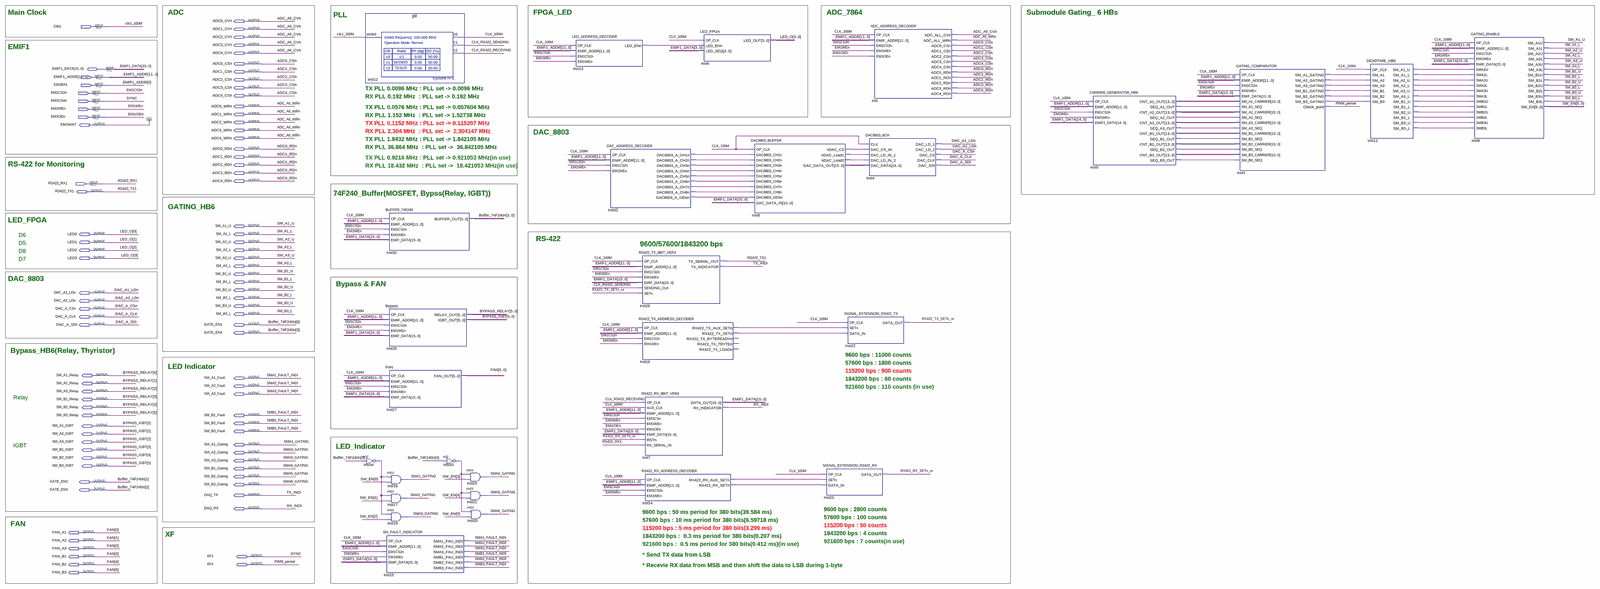
[diagram p0: schematic sheet, whole]
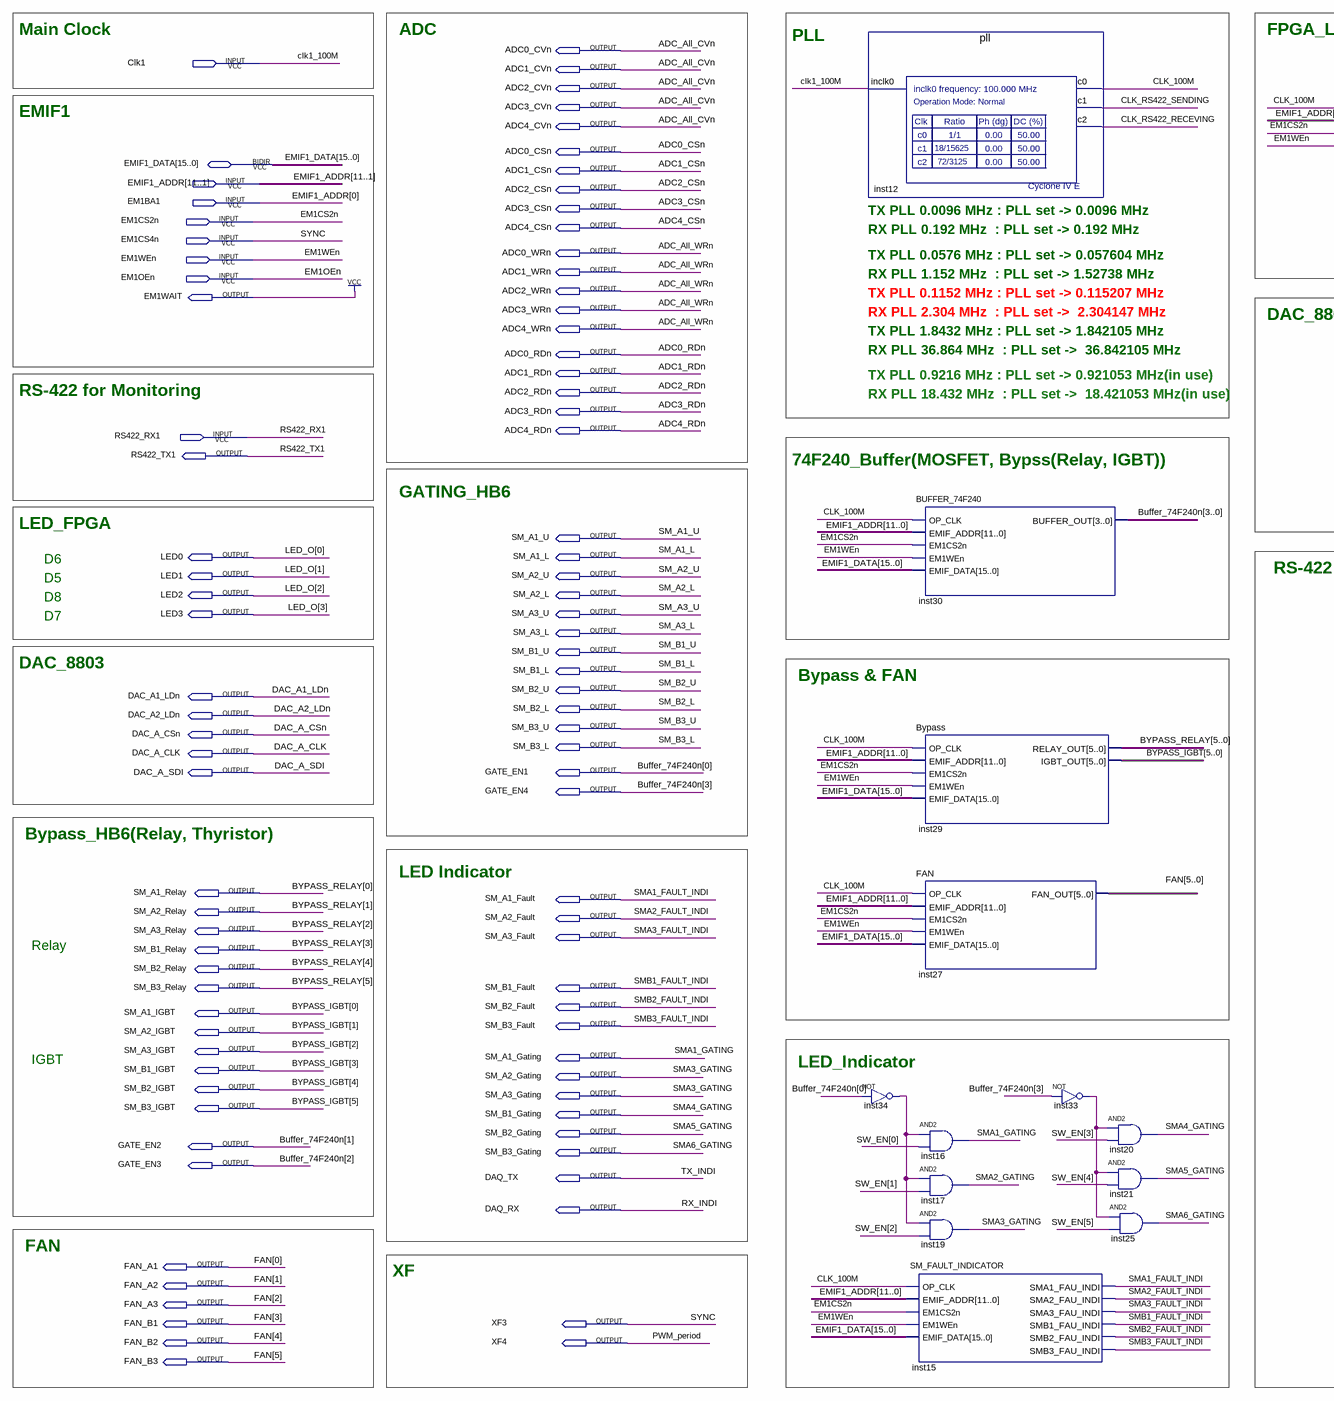
[diagram p1: schematic sheet, left part]
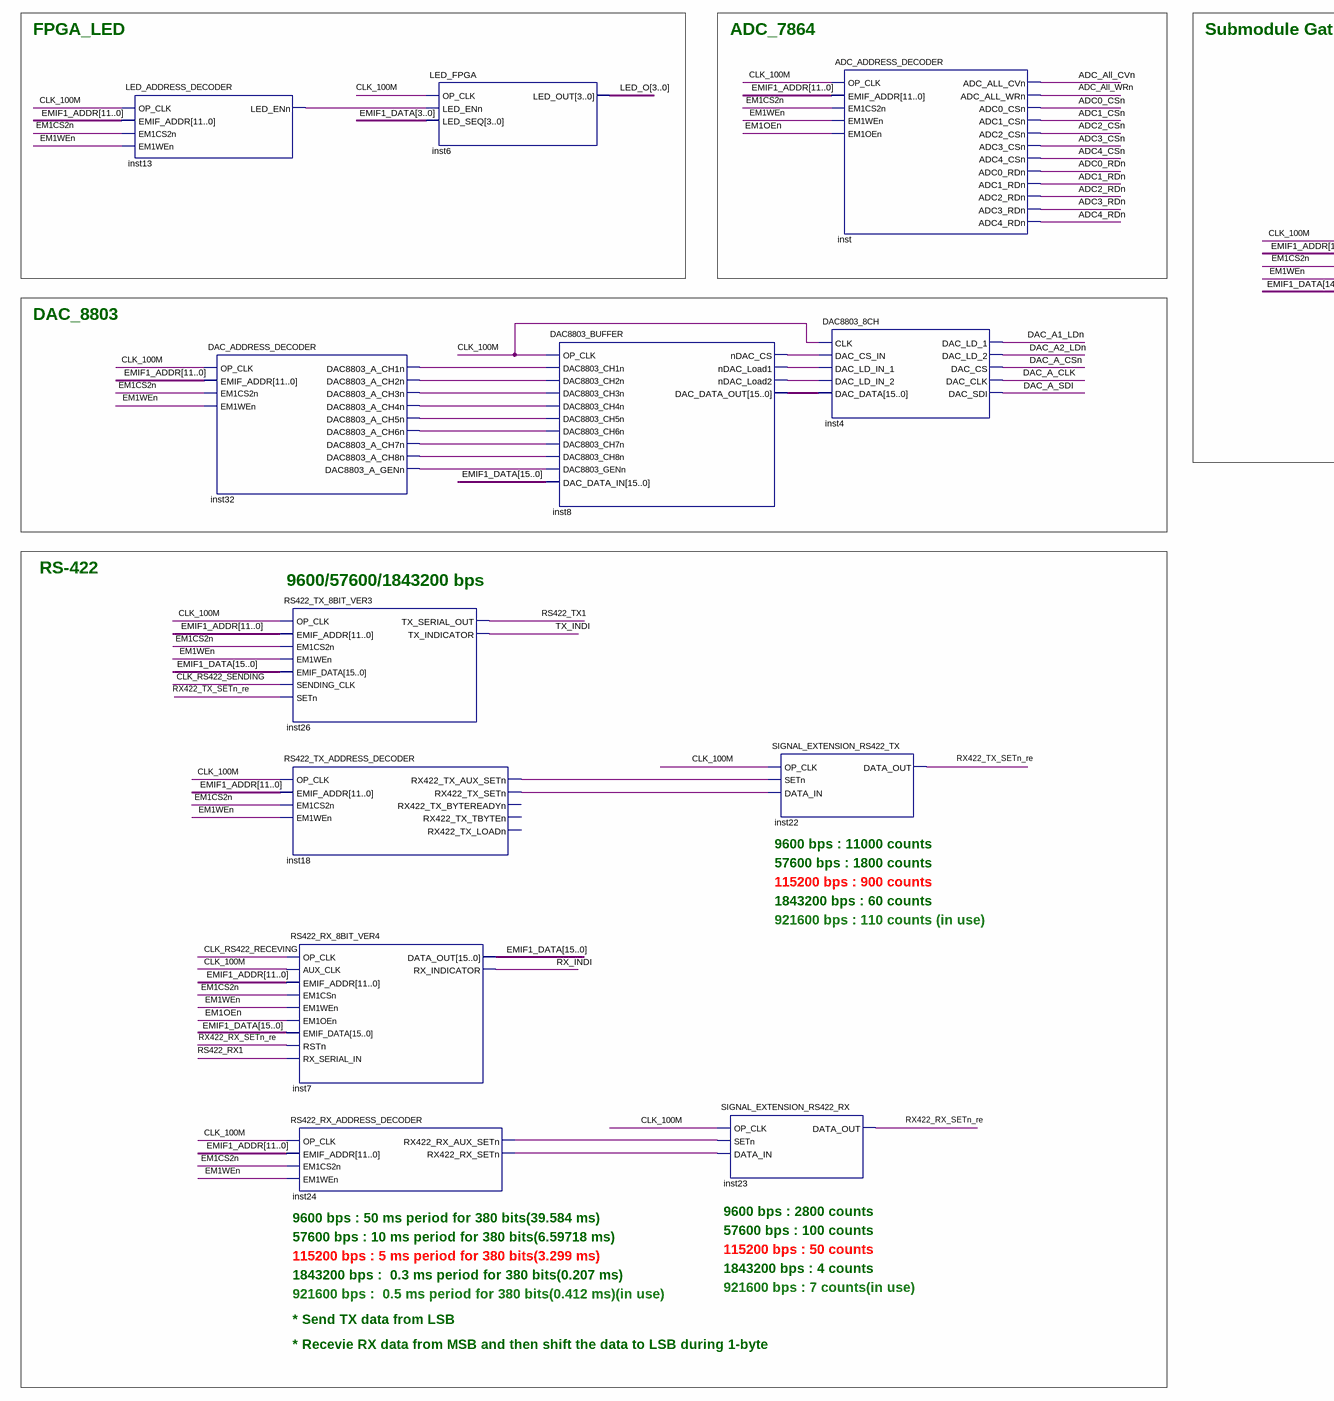
[diagram p2: schematic sheet, centre part]
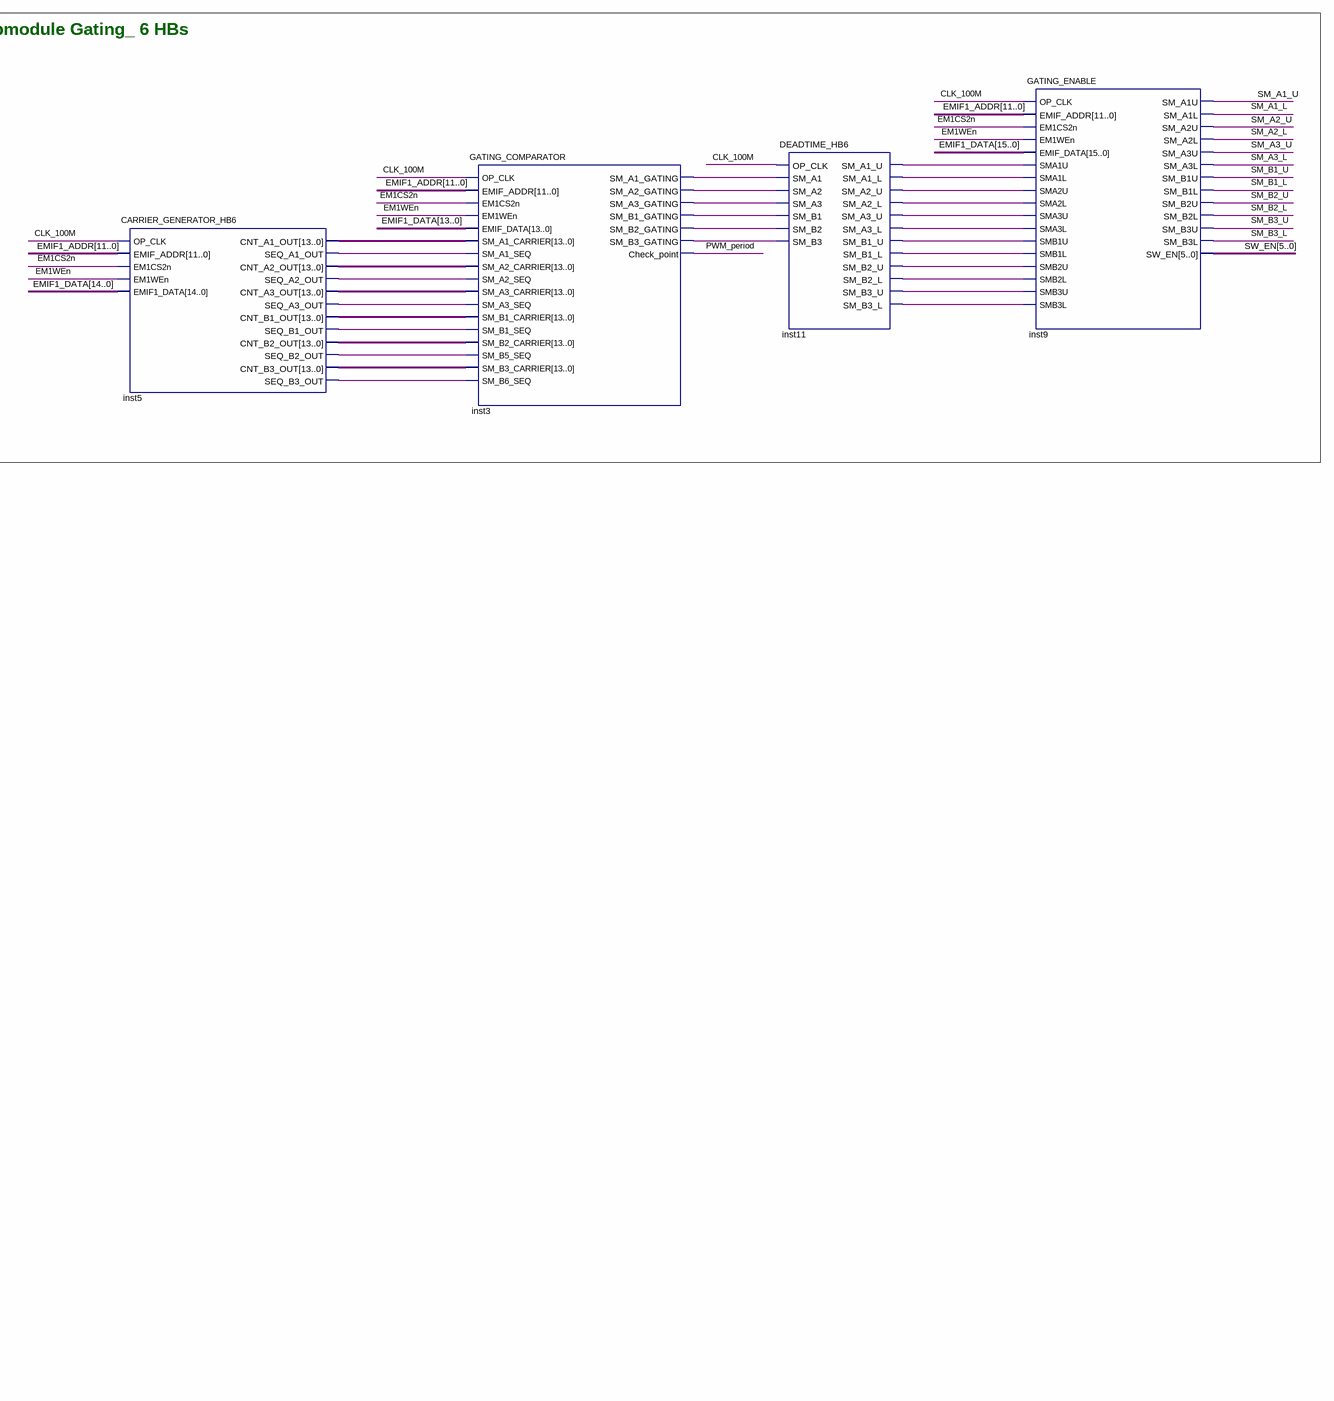
[diagram p3: schematic sheet, right part]
// Quartus schematic Groupmodule_Controller_31Lv.bdf as structural Verilog: 29 symbols, 90 pins
module Groupmodule_Controller_31Lv (
  input  Clk1,
  input  [11:1] EMIF1_ADDR,
  input  EM1BA1,
  input  EM1CS2n,
  input  EM1CS4n,
  input  EM1WEn,
  input  EM1OEn,
  input  RS422_RX1,
  inout  [15:0] EMIF1_DATA,
  output ADC0_CVn,
  output ADC1_CVn,
  output ADC2_CVn,
  output ADC3_CVn,
  output ADC4_CVn,
  output ADC0_CSn,
  output ADC1_CSn,
  output ADC2_CSn,
  output ADC3_CSn,
  output ADC4_CSn,
  output ADC0_WRn,
  output ADC1_WRn,
  output ADC2_WRn,
  output EM1WAIT,
  output ADC3_WRn,
  output ADC4_WRn,
  output ADC0_RDn,
  output ADC1_RDn,
  output ADC2_RDn,
  output ADC3_RDn,
  output ADC4_RDn,
  output RS422_TX1,
  output SM_A1_U,
  output LED0,
  output SM_A1_L,
  output LED1,
  output SM_A2_U,
  output LED2,
  output SM_A2_L,
  output LED3,
  output SM_A3_U,
  output SM_A3_L,
  output SM_B1_U,
  output SM_B1_L,
  output SM_B2_U,
  output DAC_A1_LDn,
  output SM_B2_L,
  output DAC_A2_LDn,
  output SM_B3_U,
  output DAC_A_CSn,
  output SM_B3_L,
  output DAC_A_CLK,
  output DAC_A_SDI,
  output GATE_EN1,
  output GATE_EN4,
  output SM_A1_Relay,
  output SM_A1_Fault,
  output SM_A2_Relay,
  output SM_A2_Fault,
  output SM_A3_Relay,
  output SM_A3_Fault,
  output SM_B1_Relay,
  output SM_B2_Relay,
  output SM_B3_Relay,
  output SM_B1_Fault,
  output SM_B2_Fault,
  output SM_A1_IGBT,
  output SM_B3_Fault,
  output SM_A2_IGBT,
  output SM_A3_IGBT,
  output SM_A1_Gating,
  output SM_B1_IGBT,
  output SM_A2_Gating,
  output SM_B2_IGBT,
  output SM_A3_Gating,
  output SM_B3_IGBT,
  output SM_B1_Gating,
  output SM_B2_Gating,
  output GATE_EN2,
  output SM_B3_Gating,
  output GATE_EN3,
  output DAQ_TX,
  output DAQ_RX,
  output FAN_A1,
  output FAN_A2,
  output FAN_A3,
  output FAN_B1,
  output XF3,
  output FAN_B2,
  output XF4,
  output FAN_B3
);

  wire CLK_100M, CLK_RS422_RECEVING, CLK_RS422_SENDING, inst3_sm_a1_gating, inst3_sm_a2_gating,
       inst3_sm_a3_gating, inst3_sm_b1_gating, inst3_sm_b2_gating, inst3_sm_b3_gating, inst5_seq_a1_out,
       inst5_seq_a2_out, inst5_seq_a3_out, inst5_seq_b1_out, inst5_seq_b2_out, inst5_seq_b3_out,
       inst8_ndac_cs, inst8_ndac_load1, inst8_ndac_load2, inst11_sm_a1_l, inst11_sm_a1_u, inst11_sm_a2_l,
       inst11_sm_a2_u, inst11_sm_a3_l, inst11_sm_a3_u, inst11_sm_b1_l, inst11_sm_b1_u, inst11_sm_b2_l,
       inst11_sm_b2_u, inst11_sm_b3_l, inst11_sm_b3_u, inst13_led_enn, inst18_rx422_tx_aux_setn,
       inst18_rx422_tx_setn, inst24_rx422_rx_aux_setn, inst24_rx422_rx_setn, inst32_dac8803_a_ch1n,
       inst32_dac8803_a_ch2n, inst32_dac8803_a_ch3n, inst32_dac8803_a_ch4n, inst32_dac8803_a_ch5n,
       inst32_dac8803_a_ch6n, inst32_dac8803_a_ch7n, inst32_dac8803_a_ch8n, inst32_dac8803_a_genn,
       inst33_out, inst34_out, RX422_RX_SETn_re, RX422_TX_SETn_re, SMA2_GATING;
  wire [5:0] SW_EN;
  wire [13:0] inst5_cnt_a1_out, inst5_cnt_a2_out, inst5_cnt_a3_out, inst5_cnt_b1_out, inst5_cnt_b2_out,
       inst5_cnt_b3_out;
  wire [15:0] inst8_dac_data_out;

  pll inst12 (.inclk0(Clk1), .c0(CLK_100M), .c1(CLK_RS422_SENDING), .c2(CLK_RS422_RECEVING));
  not inst34 (inst34_out, GATE_EN1);
  BUFFER_74F240 inst30 (
    .OP_CLK(CLK_100M), .EMIF_ADDR({EMIF1_ADDR, EM1BA1}), .EM1CS2n(EM1CS2n), .EM1WEn(EM1WEn),
    .EMIF_DATA(EMIF1_DATA), .BUFFER_OUT({GATE_EN4, GATE_EN3, GATE_EN2, GATE_EN1}));
  Bypass inst29 (
    .OP_CLK(CLK_100M), .EMIF_ADDR({EMIF1_ADDR, EM1BA1}), .EM1CS2n(EM1CS2n), .EM1WEn(EM1WEn),
    .EMIF_DATA(EMIF1_DATA),
    .RELAY_OUT({SM_B3_Relay, SM_B2_Relay, SM_B1_Relay, SM_A3_Relay, SM_A2_Relay, SM_A1_Relay}),
    .IGBT_OUT({SM_B3_IGBT, SM_B2_IGBT, SM_B1_IGBT, SM_A3_IGBT, SM_A2_IGBT, SM_A1_IGBT}));
  FAN inst27 (
    .OP_CLK(CLK_100M), .EMIF_ADDR({EMIF1_ADDR, EM1BA1}), .EM1CS2n(EM1CS2n), .EM1WEn(EM1WEn),
    .EMIF_DATA(EMIF1_DATA), .FAN_OUT({FAN_B3, FAN_B2, FAN_B1, FAN_A3, FAN_A2, FAN_A1}));
  and inst16 (SM_A1_Gating, inst34_out, SW_EN[0]);
  and inst17 (SMA2_GATING, inst34_out, SW_EN[1]);
  and inst19 (SM_A2_Gating, inst34_out, SW_EN[2]);
  SM_FAULT_INDICATOR inst15 (
    .OP_CLK(CLK_100M), .EMIF_ADDR({EMIF1_ADDR, EM1BA1}), .EM1CS2n(EM1CS2n), .EM1WEn(EM1WEn),
    .EMIF_DATA(EMIF1_DATA), .SMA1_FAU_INDI(SM_A1_Fault), .SMA2_FAU_INDI(SM_A2_Fault),
    .SMA3_FAU_INDI(SM_A3_Fault), .SMB1_FAU_INDI(SM_B1_Fault), .SMB2_FAU_INDI(SM_B2_Fault),
    .SMB3_FAU_INDI(SM_B3_Fault));
  not inst33 (inst33_out, GATE_EN4);
  and inst20 (SM_B1_Gating, inst33_out, SW_EN[3]);
  and inst21 (SM_B2_Gating, inst33_out, SW_EN[4]);
  and inst25 (SM_B3_Gating, inst33_out, SW_EN[5]);
  LED_ADDRESS_DECODER inst13 (
    .OP_CLK(CLK_100M), .EMIF_ADDR({EMIF1_ADDR, EM1BA1}), .EM1CS2n(EM1CS2n), .EM1WEn(EM1WEn),
    .LED_ENn(inst13_led_enn));
  DAC_ADDRESS_DECODER inst32 (
    .OP_CLK(CLK_100M), .EMIF_ADDR({EMIF1_ADDR, EM1BA1}), .EM1CS2n(EM1CS2n), .EM1WEn(EM1WEn),
    .DAC8803_A_CH1n(inst32_dac8803_a_ch1n), .DAC8803_A_CH2n(inst32_dac8803_a_ch2n),
    .DAC8803_A_CH3n(inst32_dac8803_a_ch3n), .DAC8803_A_CH4n(inst32_dac8803_a_ch4n),
    .DAC8803_A_CH5n(inst32_dac8803_a_ch5n), .DAC8803_A_CH6n(inst32_dac8803_a_ch6n),
    .DAC8803_A_CH7n(inst32_dac8803_a_ch7n), .DAC8803_A_CH8n(inst32_dac8803_a_ch8n),
    .DAC8803_A_GENn(inst32_dac8803_a_genn));
  RS422_TX_8BIT_VER3 inst26 (
    .OP_CLK(CLK_100M), .EMIF_ADDR({EMIF1_ADDR, EM1BA1}), .EM1CS2n(EM1CS2n), .EM1WEn(EM1WEn),
    .EMIF_DATA(EMIF1_DATA), .SENDING_CLK(CLK_RS422_SENDING), .SETn(RX422_TX_SETn_re),
    .TX_SERIAL_OUT(RS422_TX1), .TX_INDICATOR(DAQ_TX));
  RS422_TX_ADDRESS_DECODER inst18 (
    .OP_CLK(CLK_100M), .EMIF_ADDR({EMIF1_ADDR, EM1BA1}), .EM1CS2n(EM1CS2n), .EM1WEn(EM1WEn),
    .RX422_TX_AUX_SETn(inst18_rx422_tx_aux_setn), .RX422_TX_SETn(inst18_rx422_tx_setn));  // open: RX422_TX_BYTEREADYn, RX422_TX_TBYTEn, RX422_TX_LOADn
  RS422_RX_8BIT_VER4 inst7 (
    .OP_CLK(CLK_RS422_RECEVING), .AUX_CLK(CLK_100M), .EMIF_ADDR({EMIF1_ADDR, EM1BA1}), .EM1CSn(EM1CS2n),
    .EM1WEn(EM1WEn), .EM1OEn(EM1OEn), .EMIF_DATA(EMIF1_DATA), .RSTn(RX422_RX_SETn_re),
    .RX_SERIAL_IN(RS422_RX1), .DATA_OUT(EMIF1_DATA), .RX_INDICATOR(DAQ_RX));
  RS422_RX_ADDRESS_DECODER inst24 (
    .OP_CLK(CLK_100M), .EMIF_ADDR({EMIF1_ADDR, EM1BA1}), .EM1CS2n(EM1CS2n), .EM1WEn(EM1WEn),
    .RX422_RX_AUX_SETn(inst24_rx422_rx_aux_setn), .RX422_RX_SETn(inst24_rx422_rx_setn));
  LED_FPGA inst6 (
    .OP_CLK(CLK_100M), .LED_ENn(inst13_led_enn), .LED_SEQ(EMIF1_DATA[3:0]), .LED_OUT({LED3, LED2, LED1, LED0}));
  DAC8803_BUFFER inst8 (
    .OP_CLK(CLK_100M), .DAC8803_CH1n(inst32_dac8803_a_ch1n), .DAC8803_CH2n(inst32_dac8803_a_ch2n),
    .DAC8803_CH3n(inst32_dac8803_a_ch3n), .DAC8803_CH4n(inst32_dac8803_a_ch4n),
    .DAC8803_CH5n(inst32_dac8803_a_ch5n), .DAC8803_CH6n(inst32_dac8803_a_ch6n),
    .DAC8803_CH7n(inst32_dac8803_a_ch7n), .DAC8803_CH8n(inst32_dac8803_a_ch8n),
    .DAC8803_GENn(inst32_dac8803_a_genn), .DAC_DATA_IN(EMIF1_DATA), .nDAC_CS(inst8_ndac_cs),
    .nDAC_Load1(inst8_ndac_load1), .nDAC_Load2(inst8_ndac_load2), .DAC_DATA_OUT(inst8_dac_data_out));
  SIGNAL_EXTENSION_RS422_RX inst23 (
    .OP_CLK(CLK_100M), .SETn(inst24_rx422_rx_aux_setn), .DATA_IN(inst24_rx422_rx_setn),
    .DATA_OUT(RX422_RX_SETn_re));
  SIGNAL_EXTENSION_RS422_TX inst22 (
    .OP_CLK(CLK_100M), .SETn(inst18_rx422_tx_aux_setn), .DATA_IN(inst18_rx422_tx_setn),
    .DATA_OUT(RX422_TX_SETn_re));
  DAC8803_8CH inst4 (
    .CLK(CLK_100M), .DAC_CS_IN(inst8_ndac_cs), .DAC_LD_IN_1(inst8_ndac_load1),
    .DAC_LD_IN_2(inst8_ndac_load2), .DAC_DATA(inst8_dac_data_out), .DAC_LD_1(DAC_A1_LDn),
    .DAC_LD_2(DAC_A2_LDn), .DAC_CS(DAC_A_CSn), .DAC_CLK(DAC_A_CLK), .DAC_SDI(DAC_A_SDI));
  ADC_ADDRESS_DECODER inst (
    .OP_CLK(CLK_100M), .EMIF_ADDR({EMIF1_ADDR, EM1BA1}), .EM1CS2n(EM1CS2n), .EM1WEn(EM1WEn), .EM1OEn(EM1OEn),
    .ADC_ALL_CVn(ADC0_CVn), .ADC_ALL_WRn(ADC0_WRn), .ADC0_CSn(ADC0_CSn), .ADC1_CSn(ADC1_CSn),
    .ADC2_CSn(ADC2_CSn), .ADC3_CSn(ADC3_CSn), .ADC4_CSn(ADC4_CSn), .ADC0_RDn(ADC0_RDn), .ADC1_RDn(ADC1_RDn),
    .ADC2_RDn(ADC2_RDn), .ADC3_RDn(ADC3_RDn), .ADC4_RDn(ADC4_RDn));
  CARRIER_GENERATOR_HB6 inst5 (
    .OP_CLK(CLK_100M), .EMIF_ADDR({EMIF1_ADDR, EM1BA1}), .EM1CS2n(EM1CS2n), .EM1WEn(EM1WEn),
    .EMIF1_DATA(EMIF1_DATA[14:0]), .CNT_A1_OUT(inst5_cnt_a1_out), .SEQ_A1_OUT(inst5_seq_a1_out),
    .CNT_A2_OUT(inst5_cnt_a2_out), .SEQ_A2_OUT(inst5_seq_a2_out), .CNT_A3_OUT(inst5_cnt_a3_out),
    .SEQ_A3_OUT(inst5_seq_a3_out), .CNT_B1_OUT(inst5_cnt_b1_out), .SEQ_B1_OUT(inst5_seq_b1_out),
    .CNT_B2_OUT(inst5_cnt_b2_out), .SEQ_B2_OUT(inst5_seq_b2_out), .CNT_B3_OUT(inst5_cnt_b3_out),
    .SEQ_B3_OUT(inst5_seq_b3_out));
  GATING_COMPARATOR inst3 (
    .OP_CLK(CLK_100M), .EMIF_ADDR({EMIF1_ADDR, EM1BA1}), .EM1CS2n(EM1CS2n), .EM1WEn(EM1WEn),
    .EMIF_DATA(EMIF1_DATA[13:0]), .SM_A1_CARRIER(inst5_cnt_a1_out), .SM_A1_SEQ(inst5_seq_a1_out),
    .SM_A2_CARRIER(inst5_cnt_a2_out), .SM_A2_SEQ(inst5_seq_a2_out), .SM_A3_CARRIER(inst5_cnt_a3_out),
    .SM_A3_SEQ(inst5_seq_a3_out), .SM_B1_CARRIER(inst5_cnt_b1_out), .SM_B1_SEQ(inst5_seq_b1_out),
    .SM_B2_CARRIER(inst5_cnt_b2_out), .SM_B5_SEQ(inst5_seq_b2_out), .SM_B3_CARRIER(inst5_cnt_b3_out),
    .SM_B6_SEQ(inst5_seq_b3_out), .SM_A1_GATING(inst3_sm_a1_gating), .SM_A2_GATING(inst3_sm_a2_gating),
    .SM_A3_GATING(inst3_sm_a3_gating), .SM_B1_GATING(inst3_sm_b1_gating), .SM_B2_GATING(inst3_sm_b2_gating),
    .SM_B3_GATING(inst3_sm_b3_gating), .Check_point(XF4));
  DEADTIME_HB6 inst11 (
    .OP_CLK(CLK_100M), .SM_A1(inst3_sm_a1_gating), .SM_A2(inst3_sm_a2_gating), .SM_A3(inst3_sm_a3_gating),
    .SM_B1(inst3_sm_b1_gating), .SM_B2(inst3_sm_b2_gating), .SM_B3(inst3_sm_b3_gating),
    .SM_A1_U(inst11_sm_a1_u), .SM_A1_L(inst11_sm_a1_l), .SM_A2_U(inst11_sm_a2_u), .SM_A2_L(inst11_sm_a2_l),
    .SM_A3_U(inst11_sm_a3_u), .SM_A3_L(inst11_sm_a3_l), .SM_B1_U(inst11_sm_b1_u), .SM_B1_L(inst11_sm_b1_l),
    .SM_B2_U(inst11_sm_b2_u), .SM_B2_L(inst11_sm_b2_l), .SM_B3_U(inst11_sm_b3_u), .SM_B3_L(inst11_sm_b3_l));
  GATING_ENABLE inst9 (
    .OP_CLK(CLK_100M), .EMIF_ADDR({EMIF1_ADDR, EM1BA1}), .EM1CS2n(EM1CS2n), .EM1WEn(EM1WEn),
    .EMIF_DATA(EMIF1_DATA), .SMA1U(inst11_sm_a1_u), .SMA1L(inst11_sm_a1_l), .SMA2U(inst11_sm_a2_u),
    .SMA2L(inst11_sm_a2_l), .SMA3U(inst11_sm_a3_u), .SMA3L(inst11_sm_a3_l), .SMB1U(inst11_sm_b1_u),
    .SMB1L(inst11_sm_b1_l), .SMB2U(inst11_sm_b2_u), .SMB2L(inst11_sm_b2_l), .SMB3U(inst11_sm_b3_u),
    .SMB3L(inst11_sm_b3_l), .SM_A1U(SM_A1_U), .SM_A1L(SM_A1_L), .SM_A2U(SM_A2_U), .SM_A2L(SM_A2_L),
    .SM_A3U(SM_A3_U), .SM_A3L(SM_A3_L), .SM_B1U(SM_B1_U), .SM_B1L(SM_B1_L), .SM_B2U(SM_B2_U),
    .SM_B2L(SM_B2_L), .SM_B3U(SM_B3_U), .SM_B3L(SM_B3_L), .SW_EN(SW_EN));

  assign ADC1_CVn = ADC0_CVn;
  assign ADC1_WRn = ADC0_WRn;
  assign ADC2_CVn = ADC0_CVn;
  assign ADC2_WRn = ADC0_WRn;
  assign ADC3_CVn = ADC0_CVn;
  assign ADC3_WRn = ADC0_WRn;
  assign ADC4_CVn = ADC0_CVn;
  assign ADC4_WRn = ADC0_WRn;
  assign EM1WAIT = 1'b1;
  assign SM_A3_Gating = SM_A2_Gating;
  assign XF3 = EM1CS4n;

  // Other names for the same wires on the sheet: ADC_All_CVn = ADC0_CVn; ADC_All_WRn = ADC0_WRn;
  //   Buffer_74F240n[3:0] = {GATE_EN4, GATE_EN3, GATE_EN2, GATE_EN1};
  //   BYPASS_IGBT[5:0] = {SM_B3_IGBT, SM_B2_IGBT, SM_B1_IGBT, SM_A3_IGBT, SM_A2_IGBT, SM_A1_IGBT};
  //   BYPASS_RELAY[5:0] = {SM_B3_Relay, SM_B2_Relay, SM_B1_Relay, SM_A3_Relay, SM_A2_Relay, SM_A1_Relay};
  //   clk1_100M = Clk1; EMIF1_ADDR[0] = EM1BA1; FAN[5:0] = {FAN_B3, FAN_B2, FAN_B1, FAN_A3, FAN_A2, FAN_A1};
  //   LED_O[3:0] = {LED3, LED2, LED1, LED0}; PWM_period = XF4; RX_INDI = DAQ_RX; SMA1_FAULT_INDI = SM_A1_Fault;
  //   SMA1_GATING = SM_A1_Gating; SMA2_FAULT_INDI = SM_A2_Fault; SMA3_FAULT_INDI = SM_A3_Fault;
  //   SMA3_GATING = SM_A2_Gating; SMA4_GATING = SM_B1_Gating; SMA5_GATING = SM_B2_Gating; SMA6_GATING = SM_B3_Gating;
  //   SMB1_FAULT_INDI = SM_B1_Fault; SMB2_FAULT_INDI = SM_B2_Fault; SMB3_FAULT_INDI = SM_B3_Fault; SYNC = EM1CS4n;
  //   TX_INDI = DAQ_TX

  // Notes on the sheet:
  //   Main Clock
  //   ADC
  //   FPGA_LED
  //   ADC_7864
  //   Submodule Gating_ 6 HBs
  //   PLL
  //   EMIF1
  //   TX PLL 0.0096 MHz : PLL set -> 0.0096 MHz
  //   RX PLL 0.192 MHz  : PLL set -> 0.192 MHz
  //   TX PLL 0.0576 MHz : PLL set -> 0.057604 MHz
  //   RX PLL 1.152 MHz  : PLL set -> 1.52738 MHz
  //   TX PLL 0.1152 MHz : PLL set -> 0.115207 MHz
  //   RX PLL 2.304 MHz  : PLL set ->  2.304147 MHz
  //   DAC_8803
  //   TX PLL 1.8432 MHz : PLL set -> 1.842105 MHz
  //   RX PLL 36.864 MHz  : PLL set ->  36.842105 MHz
  //   TX PLL 0.9216 MHz : PLL set -> 0.921053 MHz(in use)
  //   RS-422 for Monitoring
  //   RX PLL 18.432 MHz  : PLL set ->  18.421053 MHz(in use)
  //   74F240_Buffer(MOSFET, Bypss(Relay, IGBT))
  //   GATING_HB6
  //   LED_FPGA
  //   D6
  //   RS-422
  //   D5
  //   9600/57600/1843200 bps
  //   D8
  //   D7
  //   DAC_8803
  //   Bypass & FAN
  //   Bypass_HB6(Relay, Thyristor)
  //   9600 bps : 11000 counts
  //   57600 bps : 1800 counts
  //   LED Indicator
  //   115200 bps : 900 counts
  //   1843200 bps : 60 counts
  //   921600 bps : 110 counts (in use)
  //   Relay
  //   IGBT
  //   LED_Indicator
  //   9600 bps : 2800 counts
  //   9600 bps : 50 ms period for 380 bits(39.584 ms)
  //   57600 bps : 100 counts
  //   57600 bps : 10 ms period for 380 bits(6.59718 ms)
  //   FAN
  //   115200 bps : 50 counts
  //   115200 bps : 5 ms period for 380 bits(3.299 ms)
  //   XF
  //   1843200 bps : 4 counts
  //   1843200 bps :  0.3 ms period for 380 bits(0.207 ms)
  //   921600 bps : 7 counts(in use)
  //   921600 bps :  0.5 ms period for 380 bits(0.412 ms)(in use)
  //   * Send TX data from LSB
  //   * Recevie RX data from MSB and then shift the data to LSB during 1-byte
endmodule
